# EAGLE design Arduino_AMRSID_tester_dual (EAGLE 9.5.1)
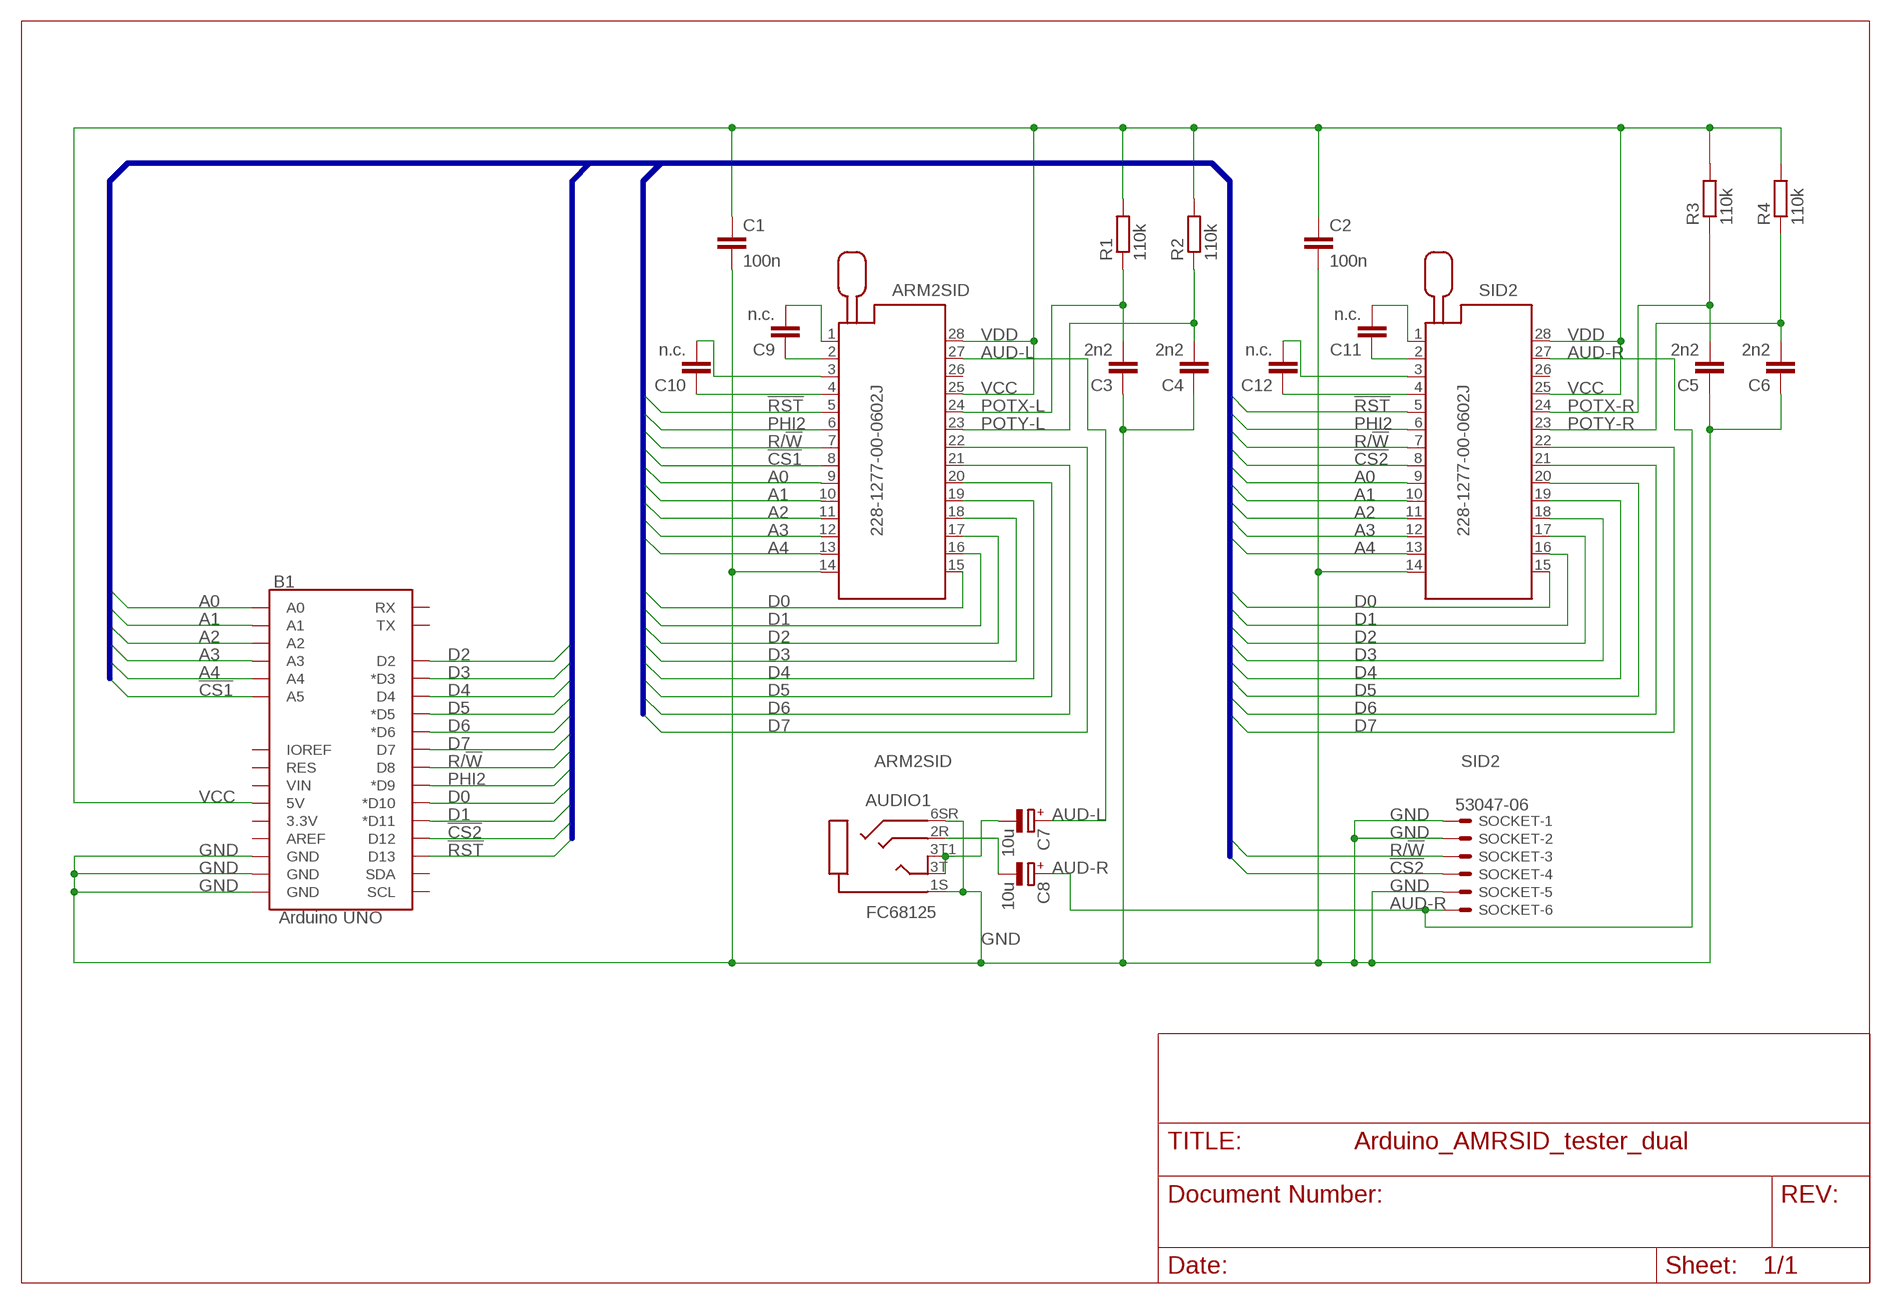
[diagram p0: schematic, sheet 1]

## Parts
ARM2SID  228-1277-00-0602J  [228-1277-00-0602J]
AUDIO1  FC68125  [FC68125]
B1  Arduino UNO  ARDUINO_UNO_R3_SHIELDBASIC  [UNO_R3_SHIELD]
C1  100n  C-EUC0805K  [C0805K]
C2  100n  C-EUC0805K  [C0805K]
C3  2n2  C-EUC0805K  [C0805K]
C4  2n2  C-EUC0805K  [C0805K]
C5  2n2  C-EUC0805K  [C0805K]
C6  2n2  C-EUC0805K  [C0805K]
C7  10u  CPOL-EUB/3528-21R  [B/3528-21R]
C8  10u  CPOL-EUB/3528-21R  [B/3528-21R]
C9  n.c.  C-EUC0805K  [C0805K]
C10  n.c.  C-EUC0805K  [C0805K]
C11  n.c.  C-EUC0805K  [C0805K]
C12  n.c.  C-EUC0805K  [C0805K]
R1  110k  R-EU_R0805  [R0805]
R2  110k  R-EU_R0805  [R0805]
R3  110k  R-EU_R0805  [R0805]
R4  110k  R-EU_R0805  [R0805]
SID2  228-1277-00-0602J  [228-1277-00-0602J]
SOCKET  53047-06  [53047-06]

## Nets
!CS1: ARM2SID.8 B1.A5
!CS2: B1.D12 SID2.8 SOCKET.4
!RST: ARM2SID.5 B1.D13 SID2.5
A0: ARM2SID.9 B1.A0 SID2.9
A1: ARM2SID.10 B1.A1 SID2.10
A2: ARM2SID.11 B1.A2 SID2.11
A3: ARM2SID.12 B1.A3 SID2.12
A4: ARM2SID.13 B1.A4 SID2.13
AUD-L: ARM2SID.27 C7.+
AUD-R: C8.+ SID2.27 SOCKET.6
D0: ARM2SID.15 B1.D10(*D10) SID2.15
D1: ARM2SID.16 B1.D11(*D11) SID2.16
D2: ARM2SID.17 B1.D2 SID2.17
D3: ARM2SID.18 B1.D3(*D3) SID2.18
D4: ARM2SID.19 B1.D4 SID2.19
D5: ARM2SID.20 B1.D5(*D5) SID2.20
D6: ARM2SID.21 B1.D6(*D6) SID2.21
D7: ARM2SID.22 B1.D7 SID2.22
GND: ARM2SID.14 AUDIO1.1S AUDIO1.6SR B1.GND@0(GND) B1.GND@1(GND) B1.GND@2(GND) C1.2 C2.2 C3.1 C4.1 C5.1 C6.1 SID2.14 SOCKET.1 SOCKET.2 SOCKET.5
N$1: AUDIO1.2R C8.-
N$2: ARM2SID.2 C9.1
N$4: AUDIO1.3T AUDIO1.3T1 C7.-
N$10: ARM2SID.1 C9.2
N$11: C11.1 SID2.2
N$12: C11.2 SID2.1
N$13: ARM2SID.4 C10.1
N$14: ARM2SID.3 C10.2
N$15: C12.1 SID2.4
N$16: C12.2 SID2.3
PHI2: ARM2SID.6 B1.D9(*D9) SID2.6
POTX-L: ARM2SID.24 C3.2 R1.1
POTX-R: C5.2 R3.1 SID2.24
POTY-L: ARM2SID.23 C4.2 R2.1
POTY-R: C6.2 R4.1 SID2.23
R/!W: ARM2SID.7 B1.D8 SID2.7 SOCKET.3
VCC: ARM2SID.25 ARM2SID.28 B1.5V C1.1 C2.1 R1.2 R2.2 R3.2 R4.2 SID2.25 SID2.28
Unconnected: ARM2SID.26 B1.3.3V B1.AREF B1.IOREF B1.RES B1.RX B1.SCL B1.SDA B1.TX B1.VIN SID2.26

## Buses
!RST,PHI2,R/!W,!CS1,!CS2,A[0..4],D[0..7]

## Notes on the sheet
- VDD | VDD
- ARM2SID | SID2

## Library data of the parts
ARM2SID SID2 = con-3m:228-?00-0602J: Zero Insertion Force Socked Source: http://www.3M.com/ehpd; MF: 3M; MPN: 228-1277-00-0602J; OC_FARNELL: 9897356; OC_NEWARK: 85K7825
AUDIO1 = JACK3.5mm_FC6812x:FC68125: Audio connector JACK 3.5mm - 4 POL ( TME - type FC68125 )
B1 = SparkFun-Boards:ARDUINO_UNO_R3_SHIELD: Arduino R3 Shield Footprint Shield form compatible with the Arduino Uno R3. SparkFun Products: MG2639 Cellular Shield <https://www.sparkfun.com/products/13120> MIDI Shield <https://www.sparkfun.com/products/12898> R3 Stackable Headers Kit <https://www.sparkfun.com/products/11417>
C1-C6 C9-C12 = rcl:C-EU: CAPACITOR, European symbol
C7 C8 = rcl:CPOL-EU: POLARIZED CAPACITOR, European symbol
R1-R4 = rcl:R-EU_: RESISTOR, European symbol
SOCKET = con-molex:53?-06: CONNECTOR wire to board 1.25 mm (.049 inch) pitch header; MPN: 53047-0610-C; OC_FARNELL: 9733078; OC_NEWARK: 03M2965

## Net classes
0 default: width 0.305 mm, clearance 0.254 mm
1 power: width 0.305 mm, clearance 0.254 mm

## Board
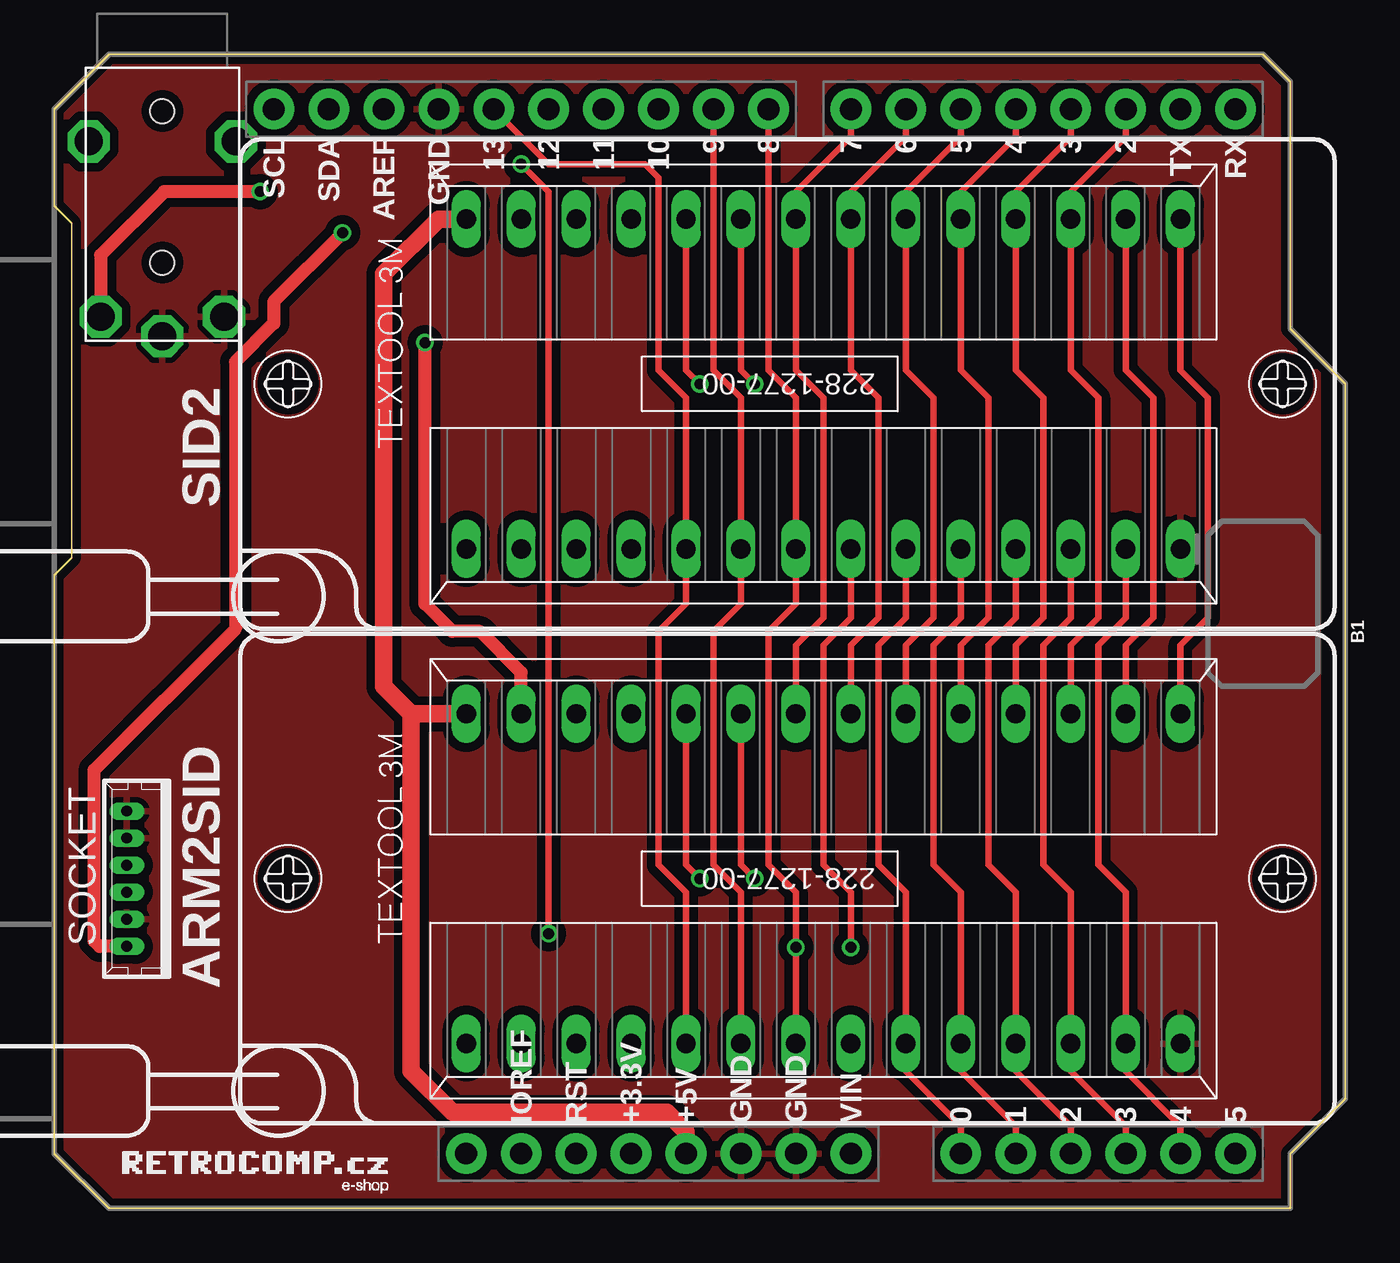
[diagram p1: board, top side]
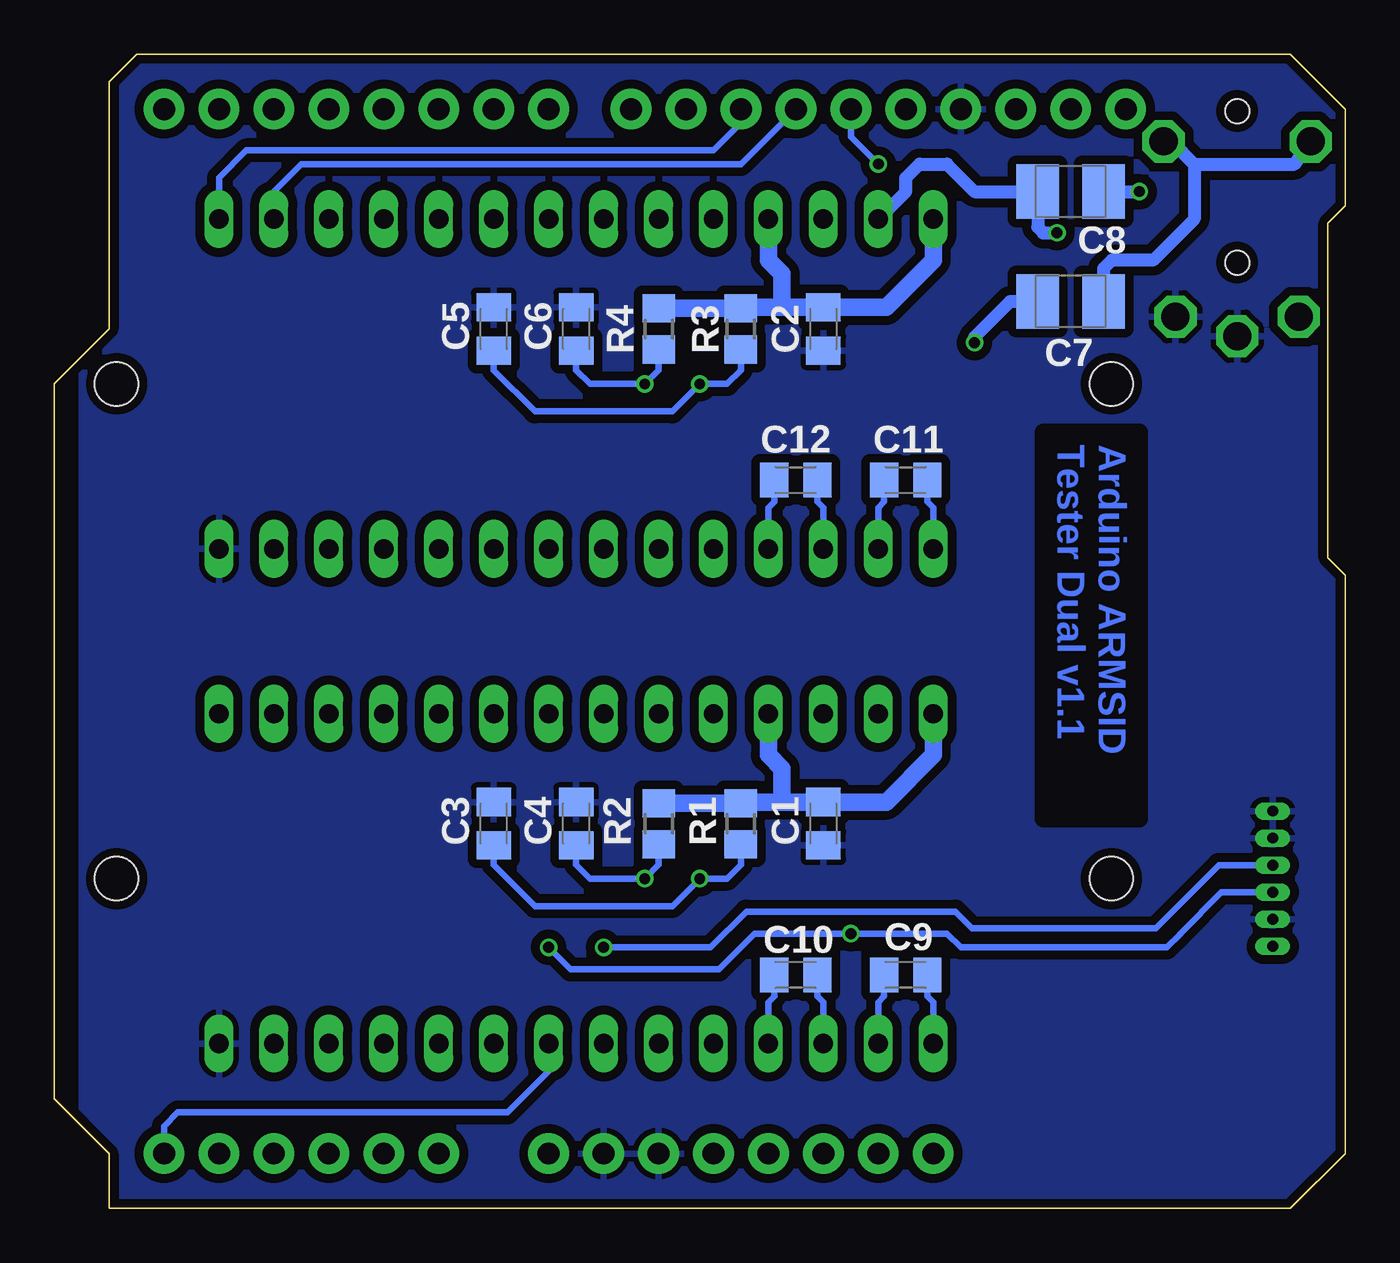
[diagram p2: board, bottom side, seen from below]

Size 59.69 x 53.34 mm. Coordinates in mm from the lower left corner, seen from the top.
Outline: 2.54,53.34 55.88,53.34 57.15,52.07 57.15,40.64 59.69,38.1 59.69,5.08 57.15,2.54 57.15,0 2.54,0 0,2.54 0,29.26 0.81,30.07 0.81,45.52 0,46.33 0,50.8 2.54,53.34
Copper layers (1*2*15*16): Top 0.035mm / dielectric 0.2mm / Route2 0.0175mm / dielectric 1.1mm / Route15 0.0175mm / dielectric 0.2mm / Bottom 0.035mm
Design rules "SeeedStudio_DRU_no_angle_20130527 *": minimum track width 6mil, minimum drill 12mil, track to track 6mil, track to pad 6mil, pad to pad 6mil, via to via 6mil, smd to smd 0mil, copper to edge 10mil, drill to drill 10mil, minimum pad ring 6mil, minimum via ring 6mil, stop-mask expansion 2mil, vias tented up to drill 25mil, thermal gap 10mil
bRestrict: area 9.5,18 to 14,35.9

### Footprints (pad centres in the part's own frame; a part is rotated, then mirrored left to right if it is on the bottom)
228-1277-00-0602J = drill 0.9 long: 1 -16.51,-7.62; 2 -13.97,-7.62; 3 -11.43,-7.62; 4 -8.89,-7.62; 5 -6.35,-7.62; 6 -3.81,-7.62; 7 -1.27,-7.62; 8 1.27,-7.62; 9 3.81,-7.62; 10 6.35,-7.62; 11 8.89,-7.62; 12 11.43,-7.62; 13 13.97,-7.62; 14 16.51,-7.62; 15 16.51,7.62; 16 13.97,7.62; 17 11.43,7.62; 18 8.89,7.62; 19 6.35,7.62; 20 3.81,7.62; 21 1.27,7.62; 22 -1.27,7.62; 23 -3.81,7.62; 24 -6.35,7.62; 25 -8.89,7.62; 26 -11.43,7.62; 27 -13.97,7.62; 28 -16.51,7.62 | hole 2: 21.24,0; -24.74,0
FC68125 = drill 1.3 octagon: 1S 0,-12.4; 2R -2.85,-11.5; 3T 3.4,-3.4; 3T1 -3.4,-3.4; 6SR 2.85,-11.5 | hole 1.1: 0,-2; 0,-9
UNO_R3_SHIELD = drill 1.016 pad 1.88: 3.3V 24.13,-2.54; 5V 24.13,0; A0 24.13,12.7; A1 24.13,15.24; A2 24.13,17.78; A3 24.13,20.32; A4 24.13,22.86; A5 24.13,25.4; AREF -24.13,-13.97; D2 -24.13,20.32; D3 -24.13,17.78; D4 -24.13,15.24; D5 -24.13,12.7; D6 -24.13,10.16; D7 -24.13,7.62; D8 -24.13,3.81; D9 -24.13,1.27; D10 -24.13,-1.27; D11 -24.13,-3.81; D12 -24.13,-6.35; D13 -24.13,-8.89; GND@0 24.13,2.54; GND@1 24.13,5.08; GND@2 -24.13,-11.43; IOREF 24.13,-7.62; NC 24.13,-10.16; RES 24.13,-5.08; RX -24.13,25.4; SCL -24.13,-19.05; SDA -24.13,-16.51; TX -24.13,22.86; VIN 24.13,7.62
C0805K = smd 1.3 x 1.6: 1 -1,0; 2 1,0
B/3528-21R = smd 1.95 x 2.5: + 1.525,0; - -1.525,0
R0805 = smd 1.3 x 1.5: 1 -0.95,0; 2 0.95,0
53047-06 = drill 0.5 pad 0.698 long: 1 3.125,0.45; 2 1.875,0.45; 3 0.625,0.45; 4 -0.625,0.45; 5 -1.875,0.45; 6 -3.125,0.45

### Placement (x,y rotation side)
ARM2SID  35.56,15.24 0 top
AUDIO1  5,52.7 0 top
B1  29.21,26.67 270 top
C1  24.13,17.78 270 bottom
C2  24.13,40.64 270 bottom
C3  39.37,17.78 270 bottom
C4  35.56,17.78 270 bottom
C5  39.37,40.64 270 bottom
C6  35.56,40.64 270 bottom
C7  12.7,41.91 180 bottom
C8  12.7,46.99 180 bottom
C9  20.32,10.79 0 bottom
C10  25.4,10.79 0 bottom
C11  20.32,33.66 0 bottom
C12  25.4,33.66 0 bottom
R1  27.94,17.78 90 bottom
R2  31.75,17.78 90 bottom
R3  27.94,40.64 90 bottom
R4  31.75,40.64 90 bottom
SID2  35.56,38.1 0 top
SOCKET  3.81,15.24 90 top

### Tracks (layer width: path | path; a pad name or v marks a point on that pad's centre or on a via)
!CS1
  Bottom 0.305: B1.A5 54.61,3.81 53.98,4.45 38.73,4.45 36.83,6.35 ARM2SID.8
!CS2  (via drill 0.5)
  Top 0.305: v22.86,12.7 22.86,46.99 v21.59,48.26 | v36.83,12.06 36.83,14.61 35.56,15.88 35.56,26.04 36.83,27.3 SID2.8
  Bottom 0.305: SOCKET.4 5.72,14.62 7.64,12.7 7.64,12.68 8.26,12.06 17.78,12.06 18.41,12.7 v22.86,12.7 27.3,12.7 28.96,11.05 35.81,11.05 v36.83,12.06 | B1.D12 22.86,49.53 v21.59,48.26
!RST
  Top 0.305: B1.D13 22.86,48.26 27.3,48.26 27.94,47.62 27.94,38.73 29.21,37.47 SID2.5 29.21,27.94 27.94,26.67 27.94,15.88 29.21,14.61 ARM2SID.5
A0
  Top 0.305: B1.A0 41.91,3.81 39.37,6.35 ARM2SID.9 39.37,14.61 38.1,15.88 38.1,26.04 39.37,27.3 SID2.9
A1
  Top 0.305: B1.A1 44.45,3.81 41.91,6.35 ARM2SID.10 41.91,14.61 40.64,15.88 40.64,26.04 41.91,27.3 SID2.10
A2
  Top 0.305: B1.A2 46.99,3.81 44.45,6.35 ARM2SID.11 44.45,14.61 43.18,15.88 43.18,26.04 44.45,27.3 SID2.11
A3
  Top 0.305: B1.A3 49.53,3.81 46.99,6.35 ARM2SID.12 46.99,14.61 45.72,15.88 45.72,26.04 46.99,27.3 SID2.12
A4
  Top 0.305: B1.A4 52.07,3.81 49.53,6.35 ARM2SID.13 49.53,14.61 48.26,15.88 48.26,26.04 49.53,27.3 SID2.13
AUD-L  (via drill 0.5)
  Top 0.61: ARM2SID.27 21.59,24.77 19.68,26.67 18.41,26.67 17.14,27.94 v17.14,40.01
  Bottom 0.61: v17.14,40.01 17.14,40.26 15.49,41.91 C7.+
AUD-R  (via drill 0.5)
  Top 0.61: SOCKET.6 2.09,12.12 1.84,12.37 1.84,20.25 8.38,26.8 8.38,39.12 10.16,40.89 10.16,41.91 v13.34,45.09
  Bottom 0.61: SID2.27 20.32,46.99 20.32,47.62 19.68,48.26 18.41,48.26 17.14,46.99 C8.+ 14.22,45.34 13.97,45.09 v13.34,45.09
D0
  Top 0.305: ARM2SID.15 52.07,26.04 53.34,27.3 53.34,37.47 52.07,38.73 SID2.15
  Bottom 0.305: B1.D10 27.94,50.16 29.21,48.9 50.8,48.9 52.07,47.62 SID2.15
D1
  Top 0.305: ARM2SID.16 49.53,26.04 50.8,27.3 50.8,37.47 49.53,38.73 SID2.16
  Bottom 0.305: B1.D11 27.94,48.26 48.26,48.26 49.53,46.99 SID2.16
D2
  Top 0.305: B1.D2 49.53,49.53 46.99,46.99 SID2.17 46.99,38.73 48.26,37.47 48.26,27.3 46.99,26.04 ARM2SID.17
D3
  Top 0.305: B1.D3 46.99,49.53 44.45,46.99 SID2.18 44.45,38.73 45.72,37.47 45.72,27.3 44.45,26.04 ARM2SID.18
D4
  Top 0.305: B1.D4 44.45,49.53 41.91,46.99 SID2.19 41.91,38.73 43.18,37.47 43.18,27.3 41.91,26.04 ARM2SID.19
D5
  Top 0.305: B1.D5 41.91,49.53 39.37,46.99 SID2.20 39.37,38.73 40.64,37.47 40.64,27.3 39.37,26.04 ARM2SID.20
D6
  Top 0.305: B1.D6 39.37,49.53 36.83,46.99 SID2.21 36.83,38.73 38.1,37.47 38.1,27.3 36.83,26.04 ARM2SID.21
D7
  Top 0.305: B1.D7 36.83,49.53 34.29,46.99 SID2.22 34.29,38.73 35.56,37.47 35.56,27.3 34.29,26.04 ARM2SID.22
GND
  pour Top (isolate 0.406): 0,53.34 58.42,53.34 58.42,0 0,0
  pour Bottom (isolate 0.406): 0,53.34 58.42,53.34 58.42,0 0,0
N$1  (via drill 0.5)
  Top 0.61: v9.53,46.99 5.08,46.99 2.15,44.06 AUDIO1.2R
  Bottom 0.61: C8.- v9.53,46.99
N$2
  Bottom 0.305: C9.1 21.32,9.79 21.59,9.53 ARM2SID.2
N$4
  Bottom 0.61: C7.- 11.18,43.44 10.79,43.81 8.89,43.81 6.99,45.72 6.99,48.26 | 6.99,48.26 8.03,49.3 AUDIO1.3T | 6.99,48.26 2.34,48.26 AUDIO1.3T1
N$10
  Bottom 0.305: C9.2 19.32,9.79 19.05,9.53 ARM2SID.1
N$11
  Bottom 0.305: C11.1 21.32,32.66 21.59,32.38 SID2.2
N$12
  Bottom 0.305: C11.2 19.32,32.66 19.05,32.38 SID2.1
N$13
  Bottom 0.305: C10.1 26.4,9.79 26.67,9.53 ARM2SID.4
N$14
  Bottom 0.305: C10.2 24.4,9.79 24.13,9.53 ARM2SID.3
N$15
  Bottom 0.305: C12.1 26.4,32.66 26.67,32.38 SID2.4
N$16
  Bottom 0.305: C12.2 24.4,32.66 24.13,32.38 SID2.3
PHI2
  Top 0.305: B1.D9 30.48,38.73 31.75,37.47 31.75,36.83 SID2.6 31.75,27.94 30.48,26.67 30.48,15.88 31.75,14.61 ARM2SID.6
POTX-L  (via drill 0.5)
  Top 0.305: ARM2SID.24 29.21,15.88 v29.84,15.24
  Bottom 0.305: R1.1 27.94,15.88 28.57,15.24 v29.84,15.24 31.11,13.97 37.47,13.97 39.37,15.88 C3.2
POTX-R  (via drill 0.5)
  Top 0.305: SID2.24 29.21,38.73 v29.84,38.1
  Bottom 0.305: R3.1 27.94,38.73 28.57,38.1 v29.84,38.1 31.11,36.83 37.47,36.83 39.37,38.73 C5.2
POTY-L  (via drill 0.5)
  Top 0.305: ARM2SID.23 31.75,15.88 v32.38,15.24
  Bottom 0.305: R2.1 31.75,15.88 v32.38,15.24 34.92,15.24 35.56,15.88 C4.2
POTY-R  (via drill 0.5)
  Top 0.305: SID2.23 31.75,38.73 v32.38,38.1
  Bottom 0.305: R4.1 31.75,38.73 v32.38,38.1 34.92,38.1 35.56,38.73 C6.2
R/!W  (via drill 0.5)
  Top 0.305: B1.D8 33.02,38.73 34.29,37.47 SID2.7 34.29,27.94 33.02,26.67 33.02,15.88 34.29,14.61 v34.29,12.06 ARM2SID.7
  Bottom 0.305: SOCKET.3 5.85,15.87 8.76,12.95 17.27,12.95 18.03,13.72 27.69,13.72 29.34,12.06 v34.29,12.06
VCC
  Top 0.813: 16.51,22.86 16.51,6.35 18.41,4.45 28.32,4.45 29.21,3.56 B1.5V | SID2.28 17.78,45.72 15.24,43.18 15.24,24.13 16.51,22.86 | 16.51,22.86 ARM2SID.28
  Bottom 0.813: SID2.28 19.05,43.81 21.23,41.64 C2.1 26.04,41.64 | 26.04,41.64 27.89,41.64 R3.2 R4.2 | SID2.25 26.67,43.81 26.04,43.18 26.04,41.64 | ARM2SID.28 19.05,20.95 21.23,18.78 C1.1 26.04,18.78 | 26.04,18.78 27.89,18.78 R1.2 R2.2 | ARM2SID.25 26.67,20.95 26.04,20.32 26.04,18.78

### Text on the board
Bottom: Arduino ARMSID | Tester Dual v1.1